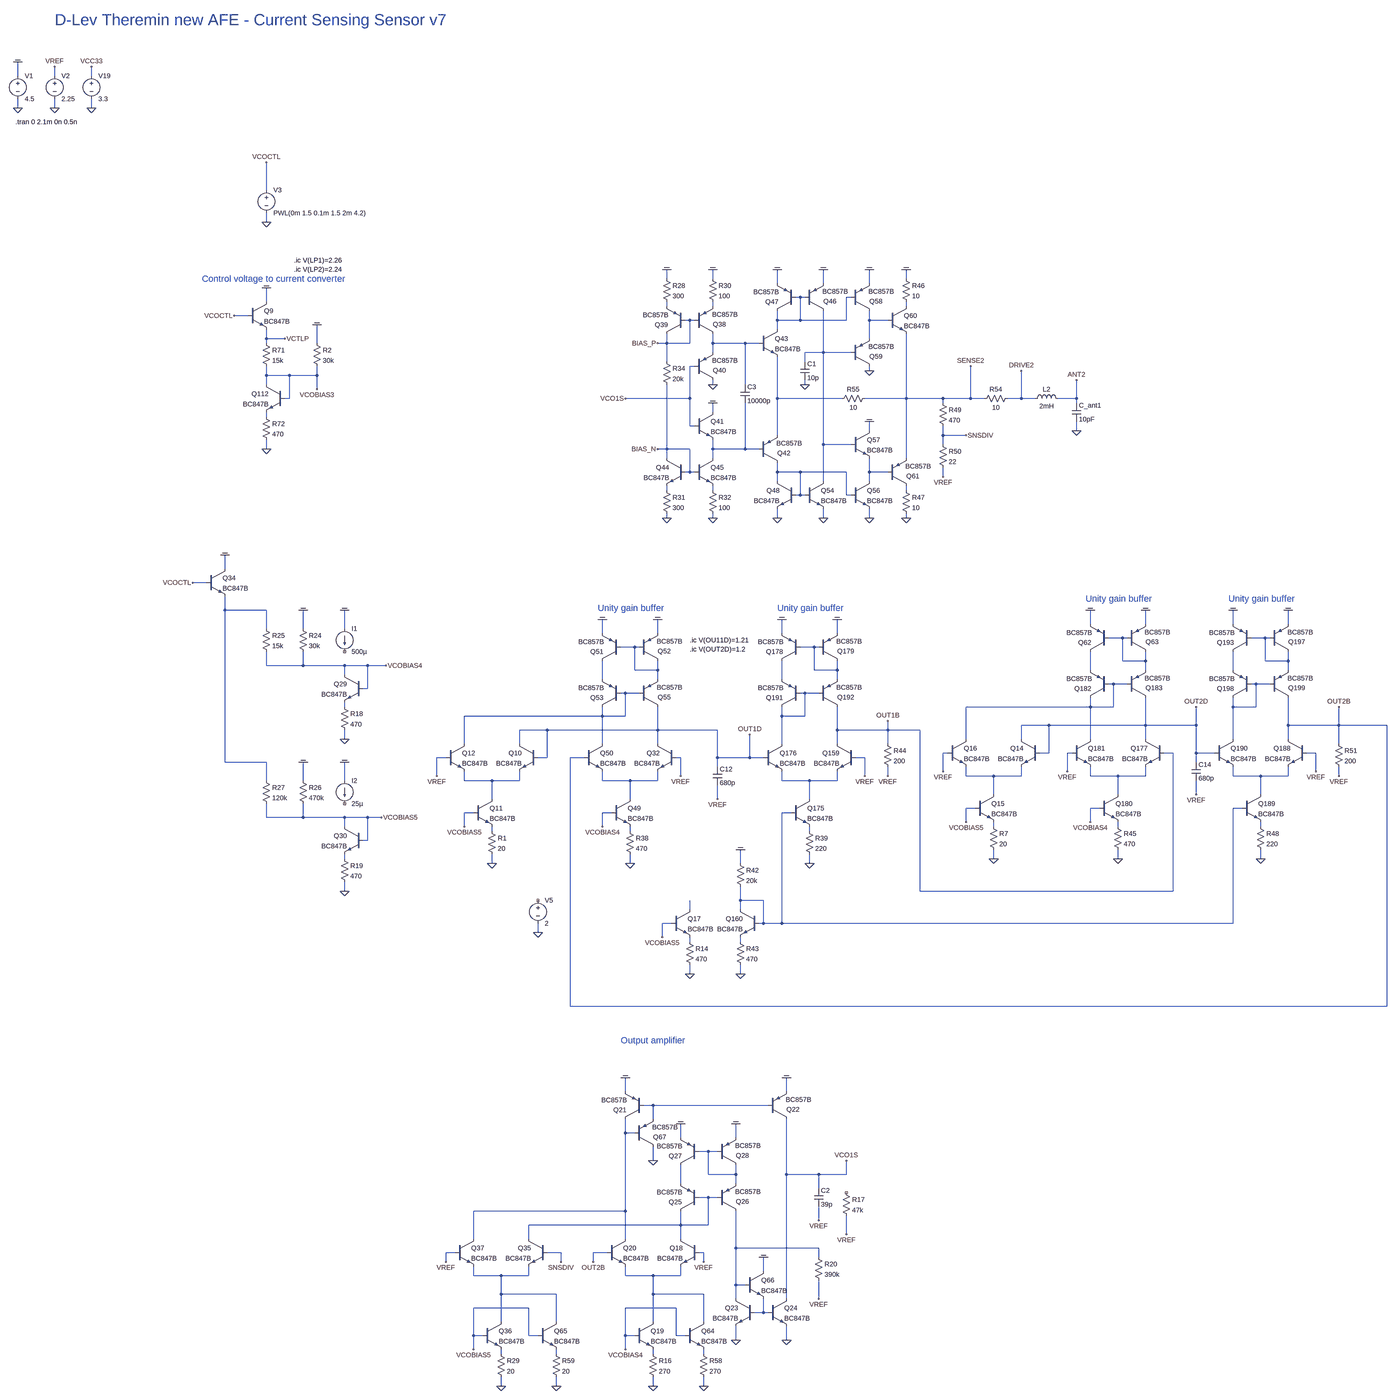
[diagram p0: schematic dlev_frontend_curr_sens_v13.asc, whole sheet]
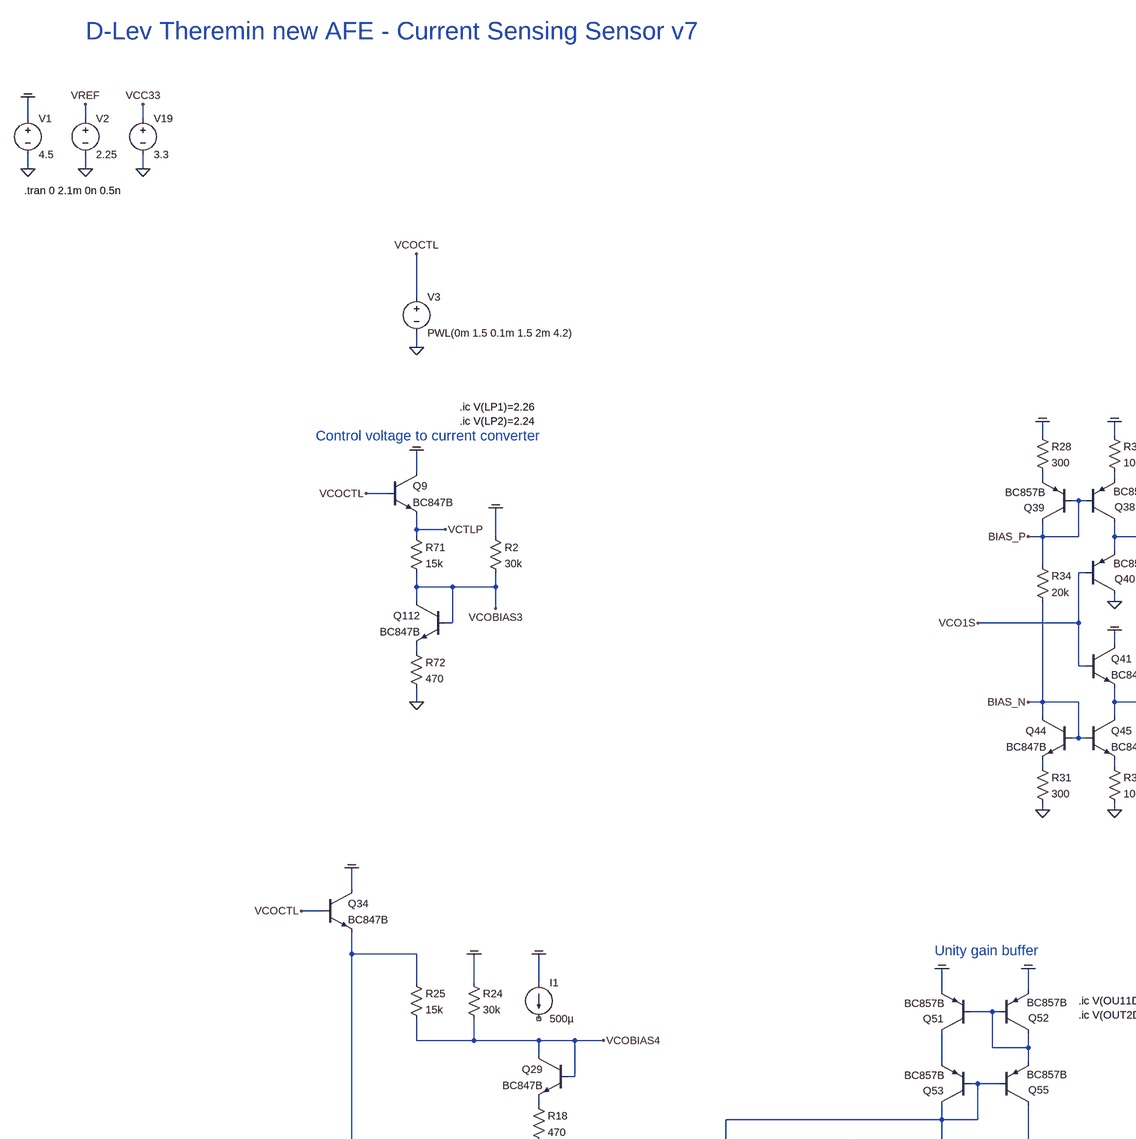
[diagram p1: schematic dlev_frontend_curr_sens_v13.asc, part, row 1 of 2, column 1 of 2]
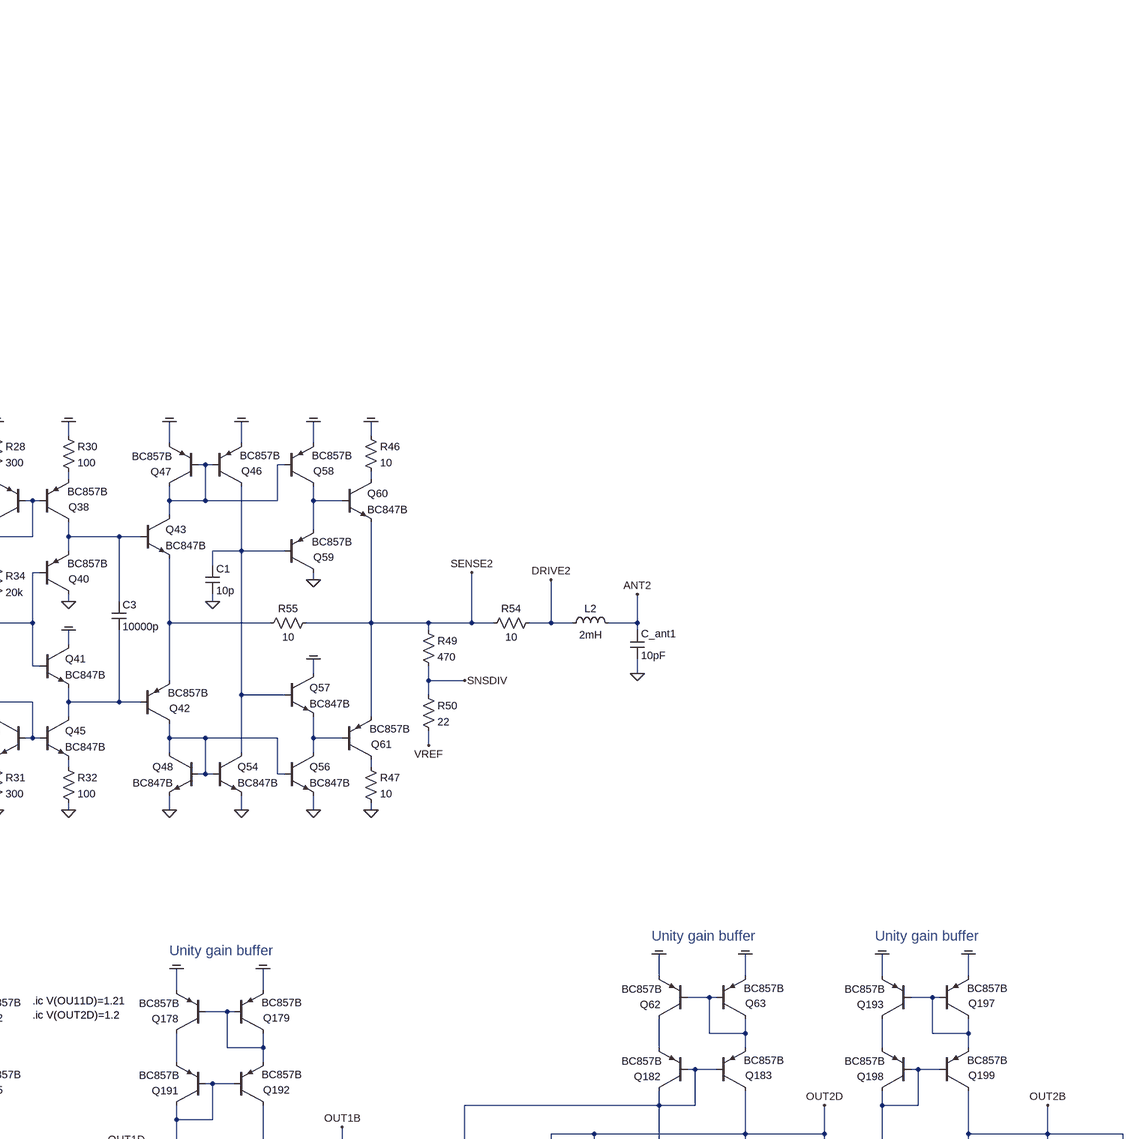
[diagram p2: schematic dlev_frontend_curr_sens_v13.asc, part, row 1 of 2, column 2 of 2]
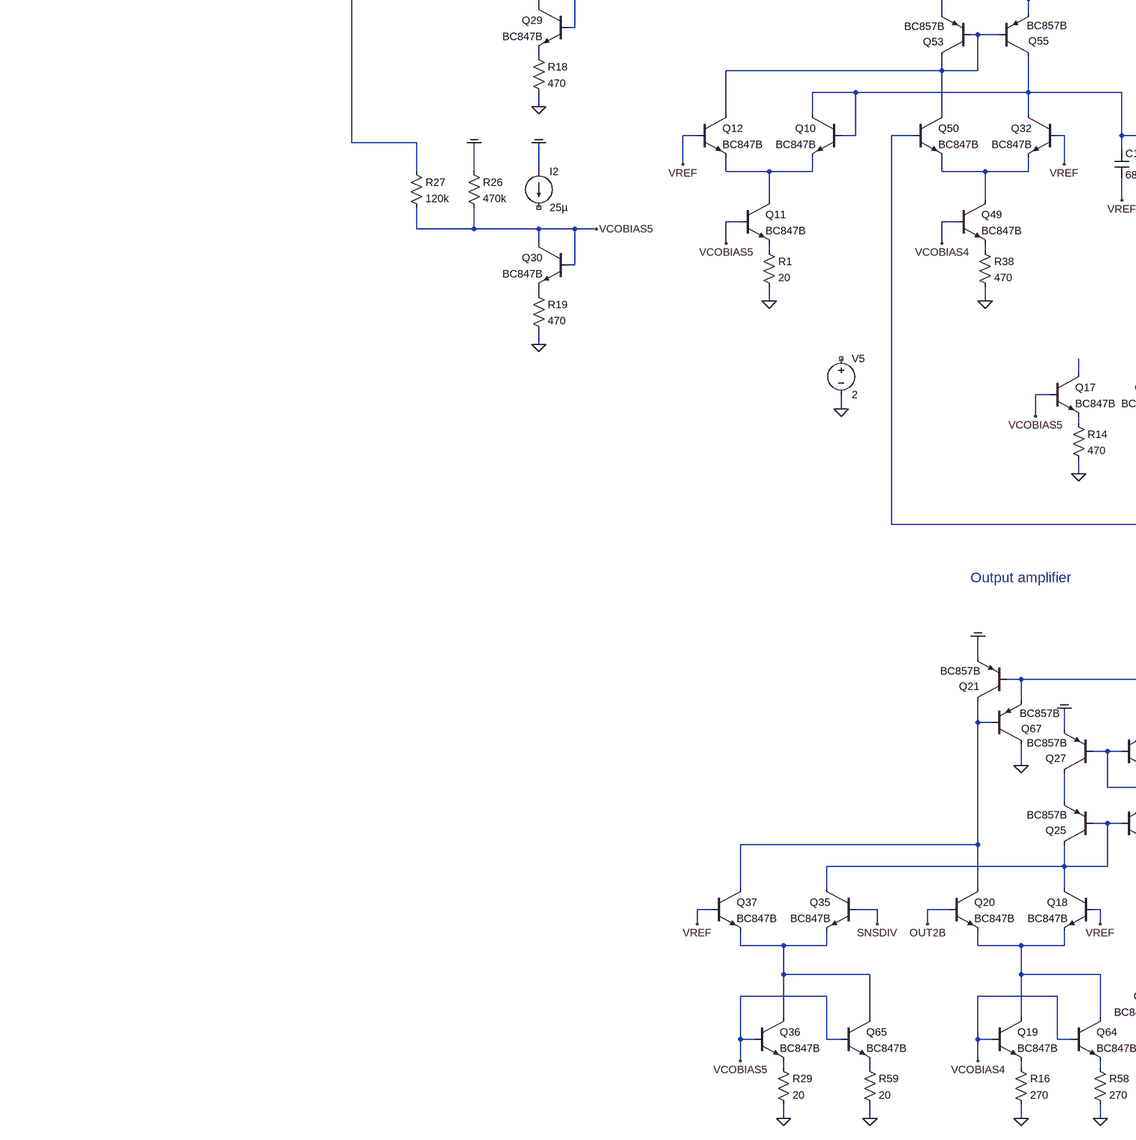
[diagram p3: schematic dlev_frontend_curr_sens_v13.asc, part, row 2 of 2, column 1 of 2]
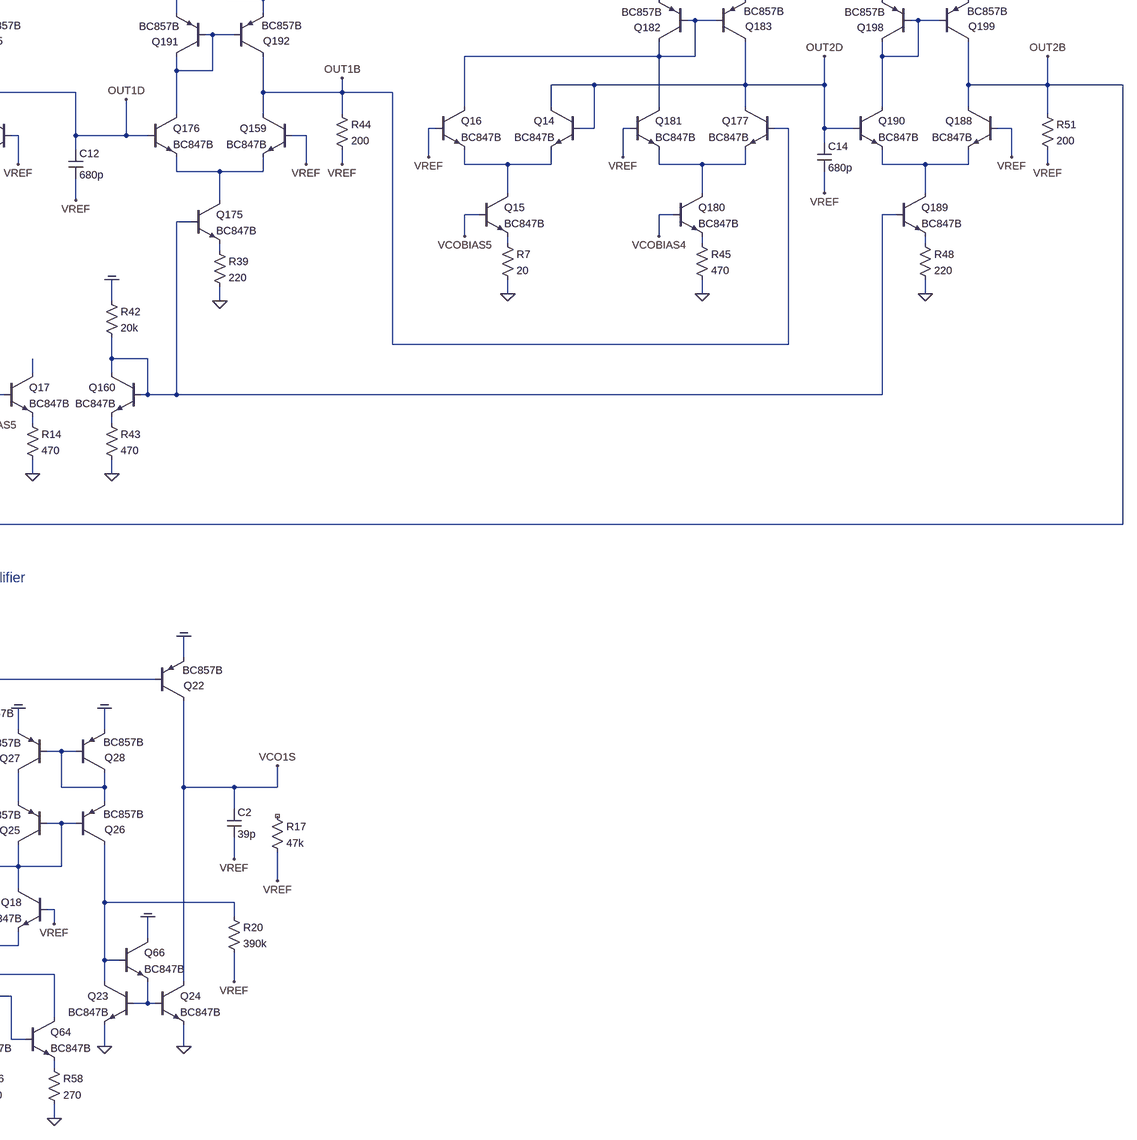
[diagram p4: schematic dlev_frontend_curr_sens_v13.asc, part, row 2 of 2, column 2 of 2]
dlev_frontend_curr_sens_v13.asc, the LTspice schematic file:
Version 4
SHEET 1 13504 15648
WIRE 48 2896 48 2848
WIRE 176 2896 176 2864
WIRE 304 2896 304 2864
WIRE 48 3008 48 2976
WIRE 176 3008 176 2976
WIRE 304 3008 304 2976
WIRE 912 3296 912 3200
WIRE 912 3408 912 3376
WIRE 2304 3616 2304 3584
WIRE 2464 3616 2464 3584
WIRE 3136 3616 3136 3584
WIRE 2688 3632 2688 3584
WIRE 2848 3632 2848 3584
WIRE 3008 3632 3008 3584
WIRE 2768 3680 2752 3680
WIRE 2784 3680 2768 3680
WIRE 2944 3680 2928 3680
WIRE 912 3696 912 3648
WIRE 2304 3712 2304 3696
WIRE 2464 3712 2464 3696
WIRE 3136 3712 3136 3696
WIRE 848 3744 800 3744
WIRE 2384 3760 2368 3760
WIRE 2400 3760 2384 3760
WIRE 2688 3760 2688 3728
WIRE 2768 3760 2768 3680
WIRE 2768 3760 2688 3760
WIRE 2928 3760 2928 3680
WIRE 2928 3760 2768 3760
WIRE 3008 3760 3008 3728
WIRE 3072 3760 3008 3760
WIRE 2688 3792 2688 3760
WIRE 912 3824 912 3792
WIRE 976 3824 912 3824
WIRE 3008 3824 3008 3760
WIRE 912 3840 912 3824
WIRE 1088 3840 1088 3776
WIRE 2304 3840 2304 3808
WIRE 2304 3840 2272 3840
WIRE 2384 3840 2384 3760
WIRE 2384 3840 2304 3840
WIRE 2464 3840 2464 3808
WIRE 2576 3840 2464 3840
WIRE 2624 3840 2576 3840
WIRE 2464 3872 2464 3840
WIRE 2848 3872 2848 3728
WIRE 2848 3872 2784 3872
WIRE 2944 3872 2848 3872
WIRE 2304 3904 2304 3840
WIRE 2784 3904 2784 3872
WIRE 2400 3920 2384 3920
WIRE 3008 3936 3008 3920
WIRE 912 3952 912 3920
WIRE 992 3952 912 3952
WIRE 1088 3952 1088 3920
WIRE 1088 3952 992 3952
WIRE 912 3984 912 3952
WIRE 2464 3984 2464 3968
WIRE 2576 3984 2576 3840
WIRE 2784 3984 2784 3968
WIRE 1088 4000 1088 3952
WIRE 992 4032 992 3952
WIRE 992 4032 976 4032
WIRE 2384 4032 2384 3920
WIRE 2384 4032 2160 4032
WIRE 2688 4032 2688 3888
WIRE 2912 4032 2688 4032
WIRE 3136 4032 3136 3808
WIRE 3136 4032 2992 4032
WIRE 3264 4032 3136 4032
WIRE 3360 4032 3360 3920
WIRE 3360 4032 3264 4032
WIRE 3408 4032 3360 4032
WIRE 3536 4032 3536 3936
WIRE 3536 4032 3488 4032
WIRE 3584 4032 3536 4032
WIRE 3728 4032 3728 3968
WIRE 3728 4032 3664 4032
WIRE 3264 4048 3264 4032
WIRE 3728 4048 3728 4032
WIRE 2464 4080 2464 4048
WIRE 912 4096 912 4080
WIRE 2384 4128 2384 4032
WIRE 2400 4128 2384 4128
WIRE 3008 4144 3008 4112
WIRE 3728 4144 3728 4112
WIRE 2688 4160 2688 4032
WIRE 3264 4160 3264 4128
WIRE 3344 4160 3264 4160
WIRE 2848 4192 2848 3872
WIRE 2944 4192 2848 4192
WIRE 3264 4192 3264 4160
WIRE 912 4208 912 4176
WIRE 2304 4208 2304 3984
WIRE 2304 4208 2272 4208
WIRE 2384 4208 2304 4208
WIRE 2464 4208 2464 4176
WIRE 2576 4208 2576 4048
WIRE 2576 4208 2464 4208
WIRE 2624 4208 2576 4208
WIRE 2304 4240 2304 4208
WIRE 2464 4240 2464 4208
WIRE 3136 4240 3136 4032
WIRE 2384 4288 2384 4208
WIRE 2384 4288 2368 4288
WIRE 2400 4288 2384 4288
WIRE 2688 4288 2688 4256
WIRE 2768 4288 2688 4288
WIRE 2928 4288 2768 4288
WIRE 3008 4288 3008 4240
WIRE 3072 4288 3008 4288
WIRE 3264 4304 3264 4272
WIRE 2688 4320 2688 4288
WIRE 2848 4320 2848 4192
WIRE 3008 4320 3008 4288
WIRE 2304 4352 2304 4336
WIRE 2464 4352 2464 4336
WIRE 3136 4352 3136 4336
WIRE 2768 4368 2768 4288
WIRE 2768 4368 2752 4368
WIRE 2784 4368 2768 4368
WIRE 2928 4368 2928 4288
WIRE 2944 4368 2928 4368
WIRE 2304 4448 2304 4432
WIRE 2464 4448 2464 4432
WIRE 2688 4448 2688 4416
WIRE 2848 4448 2848 4416
WIRE 3008 4448 3008 4416
WIRE 3136 4448 3136 4432
WIRE 768 4624 768 4576
WIRE 704 4672 656 4672
WIRE 768 4768 768 4720
WIRE 912 4768 768 4768
WIRE 3776 4816 3776 4768
WIRE 3968 4816 3968 4768
WIRE 4272 4816 4272 4768
WIRE 4464 4816 4464 4768
WIRE 912 4832 912 4768
WIRE 1040 4832 1040 4768
WIRE 1184 4832 1184 4768
WIRE 2080 4848 2080 4800
WIRE 2272 4848 2272 4800
WIRE 2704 4848 2704 4800
WIRE 2896 4848 2896 4800
WIRE 3888 4864 3840 4864
WIRE 3904 4864 3888 4864
WIRE 4384 4864 4336 4864
WIRE 4400 4864 4384 4864
WIRE 2192 4896 2144 4896
WIRE 2208 4896 2192 4896
WIRE 2816 4896 2768 4896
WIRE 2832 4896 2816 4896
WIRE 3888 4944 3888 4864
WIRE 3968 4944 3968 4912
WIRE 3968 4944 3888 4944
WIRE 4384 4944 4384 4864
WIRE 4464 4944 4464 4912
WIRE 4464 4944 4384 4944
WIRE 912 4960 912 4912
WIRE 1040 4960 1040 4912
WIRE 1040 4960 912 4960
WIRE 1184 4960 1040 4960
WIRE 1264 4960 1184 4960
WIRE 1328 4960 1264 4960
WIRE 2192 4976 2192 4896
WIRE 2272 4976 2272 4944
WIRE 2272 4976 2192 4976
WIRE 2816 4976 2816 4896
WIRE 2896 4976 2896 4944
WIRE 2896 4976 2816 4976
WIRE 3776 4976 3776 4912
WIRE 3968 4976 3968 4944
WIRE 4272 4976 4272 4912
WIRE 4464 4976 4464 4944
WIRE 1184 4992 1184 4960
WIRE 2080 5008 2080 4944
WIRE 2272 5008 2272 4976
WIRE 2704 5008 2704 4944
WIRE 2896 5008 2896 4976
WIRE 3856 5024 3840 5024
WIRE 3904 5024 3856 5024
WIRE 4352 5024 4336 5024
WIRE 4400 5024 4352 5024
WIRE 1264 5040 1264 4960
WIRE 1264 5040 1248 5040
WIRE 2160 5056 2144 5056
WIRE 2208 5056 2160 5056
WIRE 2784 5056 2768 5056
WIRE 2832 5056 2784 5056
WIRE 1184 5104 1184 5088
WIRE 3776 5104 3776 5072
WIRE 3776 5104 3344 5104
WIRE 3856 5104 3856 5024
WIRE 3856 5104 3776 5104
WIRE 4272 5104 4272 5072
WIRE 4352 5104 4352 5024
WIRE 4352 5104 4272 5104
WIRE 2080 5136 2080 5104
WIRE 2080 5136 1600 5136
WIRE 2160 5136 2160 5056
WIRE 2160 5136 2080 5136
WIRE 2704 5136 2704 5104
WIRE 2784 5136 2784 5056
WIRE 2784 5136 2704 5136
WIRE 3632 5168 3536 5168
WIRE 3968 5168 3968 5072
WIRE 3968 5168 3632 5168
WIRE 4144 5168 4144 5104
WIRE 4144 5168 3968 5168
WIRE 4464 5168 4464 5072
WIRE 4640 5168 4640 5104
WIRE 4640 5168 4464 5168
WIRE 4832 5168 4640 5168
WIRE 1888 5184 1792 5184
WIRE 2272 5184 2272 5104
WIRE 2272 5184 1888 5184
WIRE 2480 5184 2272 5184
WIRE 2896 5184 2896 5104
WIRE 3072 5184 3072 5152
WIRE 3072 5184 2896 5184
WIRE 3184 5184 3072 5184
WIRE 1184 5216 1184 5184
WIRE 3344 5216 3344 5104
WIRE 3536 5216 3536 5168
WIRE 3776 5216 3776 5104
WIRE 3968 5216 3968 5168
WIRE 4272 5216 4272 5104
WIRE 4464 5216 4464 5168
WIRE 1600 5232 1600 5136
WIRE 1792 5232 1792 5184
WIRE 2080 5232 2080 5136
WIRE 2272 5232 2272 5184
WIRE 2704 5232 2704 5136
WIRE 2896 5232 2896 5184
WIRE 3072 5232 3072 5184
WIRE 4640 5232 4640 5168
WIRE 3280 5264 3264 5264
WIRE 3632 5264 3632 5168
WIRE 3632 5264 3600 5264
WIRE 3712 5264 3696 5264
WIRE 4064 5264 4032 5264
WIRE 4144 5264 4144 5168
WIRE 4208 5264 4144 5264
WIRE 4560 5264 4528 5264
WIRE 1536 5280 1504 5280
WIRE 1888 5280 1888 5184
WIRE 1888 5280 1856 5280
WIRE 2016 5280 1968 5280
WIRE 2352 5280 2336 5280
WIRE 2480 5280 2480 5184
WIRE 2592 5280 2592 5200
WIRE 2592 5280 2480 5280
WIRE 2640 5280 2592 5280
WIRE 2992 5280 2960 5280
WIRE 768 5296 768 4768
WIRE 912 5296 768 5296
WIRE 4144 5296 4144 5264
WIRE 2480 5312 2480 5280
WIRE 3264 5328 3264 5264
WIRE 3696 5328 3696 5264
WIRE 4560 5328 4560 5264
WIRE 1504 5344 1504 5280
WIRE 2352 5344 2352 5280
WIRE 2992 5344 2992 5280
WIRE 3072 5344 3072 5312
WIRE 3344 5344 3344 5312
WIRE 3440 5344 3344 5344
WIRE 3536 5344 3536 5312
WIRE 3536 5344 3440 5344
WIRE 3776 5344 3776 5312
WIRE 3872 5344 3776 5344
WIRE 3968 5344 3968 5312
WIRE 3968 5344 3872 5344
WIRE 4272 5344 4272 5312
WIRE 4368 5344 4272 5344
WIRE 4464 5344 4464 5312
WIRE 4464 5344 4368 5344
WIRE 4640 5344 4640 5312
WIRE 912 5360 912 5296
WIRE 1040 5360 1040 5296
WIRE 1184 5360 1184 5296
WIRE 1600 5360 1600 5328
WIRE 1696 5360 1600 5360
WIRE 1792 5360 1792 5328
WIRE 1792 5360 1696 5360
WIRE 2080 5360 2080 5328
WIRE 2176 5360 2080 5360
WIRE 2272 5360 2272 5328
WIRE 2272 5360 2176 5360
WIRE 2704 5360 2704 5328
WIRE 2800 5360 2704 5360
WIRE 2896 5360 2896 5328
WIRE 2896 5360 2800 5360
WIRE 3440 5408 3440 5344
WIRE 3872 5408 3872 5344
WIRE 4144 5408 4144 5360
WIRE 4368 5408 4368 5344
WIRE 1696 5424 1696 5360
WIRE 2176 5424 2176 5360
WIRE 2480 5424 2480 5376
WIRE 2800 5424 2800 5360
WIRE 3376 5456 3344 5456
WIRE 3808 5456 3776 5456
WIRE 4304 5456 4272 5456
WIRE 1632 5472 1600 5472
WIRE 2112 5472 2080 5472
WIRE 2736 5472 2704 5472
WIRE 912 5488 912 5440
WIRE 1040 5488 1040 5440
WIRE 1040 5488 912 5488
WIRE 1184 5488 1040 5488
WIRE 1264 5488 1184 5488
WIRE 1312 5488 1264 5488
WIRE 3344 5504 3344 5456
WIRE 3776 5504 3776 5456
WIRE 1184 5520 1184 5488
WIRE 1600 5520 1600 5472
WIRE 2080 5520 2080 5472
WIRE 3440 5520 3440 5504
WIRE 3872 5520 3872 5504
WIRE 4368 5520 4368 5504
WIRE 1696 5536 1696 5520
WIRE 2176 5536 2176 5520
WIRE 2800 5536 2800 5520
WIRE 1264 5568 1264 5488
WIRE 1264 5568 1248 5568
WIRE 1184 5632 1184 5616
WIRE 3440 5632 3440 5600
WIRE 3872 5632 3872 5600
WIRE 4368 5632 4368 5600
WIRE 1696 5648 1696 5616
WIRE 2176 5648 2176 5616
WIRE 2560 5648 2560 5600
WIRE 2800 5648 2800 5616
WIRE 1184 5744 1184 5712
WIRE 3184 5744 3184 5184
WIRE 4064 5744 4064 5264
WIRE 4064 5744 3184 5744
WIRE 2560 5776 2560 5728
WIRE 2640 5776 2560 5776
WIRE 2384 5808 2384 5776
WIRE 2560 5808 2560 5776
WIRE 2320 5856 2288 5856
WIRE 2640 5856 2640 5776
WIRE 2640 5856 2624 5856
WIRE 2704 5856 2704 5472
WIRE 2704 5856 2640 5856
WIRE 4272 5856 4272 5456
WIRE 4272 5856 2704 5856
WIRE 1856 5888 1856 5856
WIRE 2288 5904 2288 5856
WIRE 2384 5920 2384 5904
WIRE 2560 5920 2560 5904
WIRE 2384 6032 2384 6000
WIRE 2560 6032 2560 6000
WIRE 1968 6144 1968 5280
WIRE 4832 6144 4832 5168
WIRE 4832 6144 1968 6144
WIRE 2160 6592 2160 6544
WIRE 2720 6592 2720 6544
WIRE 2256 6640 2224 6640
WIRE 2656 6640 2256 6640
WIRE 2256 6688 2256 6640
WIRE 2160 6736 2160 6688
WIRE 2192 6736 2160 6736
WIRE 2352 6752 2352 6704
WIRE 2544 6752 2544 6704
WIRE 2448 6800 2416 6800
WIRE 2480 6800 2448 6800
WIRE 2256 6832 2256 6784
WIRE 2448 6880 2448 6800
WIRE 2544 6880 2544 6848
WIRE 2544 6880 2448 6880
WIRE 2720 6880 2720 6688
WIRE 2832 6880 2720 6880
WIRE 2928 6880 2928 6832
WIRE 2928 6880 2832 6880
WIRE 2352 6912 2352 6848
WIRE 2544 6912 2544 6880
WIRE 2832 6928 2832 6880
WIRE 2448 6960 2416 6960
WIRE 2480 6960 2448 6960
WIRE 2160 7008 2160 6736
WIRE 2160 7008 1632 7008
WIRE 2832 7040 2832 6992
WIRE 2352 7056 2352 7008
WIRE 2352 7056 1824 7056
WIRE 2448 7056 2448 6960
WIRE 2448 7056 2352 7056
WIRE 2928 7088 2928 7024
WIRE 1632 7104 1632 7008
WIRE 1824 7104 1824 7056
WIRE 2160 7104 2160 7008
WIRE 2352 7104 2352 7056
WIRE 2544 7136 2544 7008
WIRE 2832 7136 2544 7136
WIRE 1568 7152 1536 7152
WIRE 1936 7152 1888 7152
WIRE 2096 7152 2048 7152
WIRE 2432 7152 2416 7152
WIRE 2832 7168 2832 7136
WIRE 1536 7184 1536 7152
WIRE 1936 7184 1936 7152
WIRE 2048 7184 2048 7152
WIRE 2432 7184 2432 7152
WIRE 2640 7216 2640 7168
WIRE 1632 7232 1632 7200
WIRE 1728 7232 1632 7232
WIRE 1824 7232 1824 7200
WIRE 1824 7232 1728 7232
WIRE 2160 7232 2160 7200
WIRE 2256 7232 2160 7232
WIRE 2352 7232 2352 7200
WIRE 2352 7232 2256 7232
WIRE 2544 7264 2544 7136
WIRE 2576 7264 2544 7264
WIRE 1728 7296 1728 7232
WIRE 1920 7296 1728 7296
WIRE 2256 7296 2256 7232
WIRE 2432 7296 2256 7296
WIRE 2544 7312 2544 7264
WIRE 2720 7312 2720 6880
WIRE 2832 7312 2832 7248
WIRE 1824 7344 1632 7344
WIRE 2336 7344 2160 7344
WIRE 2640 7360 2640 7312
WIRE 2640 7360 2608 7360
WIRE 2656 7360 2640 7360
WIRE 1728 7392 1728 7296
WIRE 1920 7392 1920 7296
WIRE 2256 7392 2256 7296
WIRE 2432 7392 2432 7296
WIRE 1632 7440 1632 7344
WIRE 1664 7440 1632 7440
WIRE 1824 7440 1824 7344
WIRE 1856 7440 1824 7440
WIRE 2160 7440 2160 7344
WIRE 2192 7440 2160 7440
WIRE 2336 7440 2336 7344
WIRE 2368 7440 2336 7440
WIRE 2544 7456 2544 7408
WIRE 2720 7456 2720 7408
WIRE 1632 7488 1632 7440
WIRE 2160 7488 2160 7440
WIRE 1728 7504 1728 7488
WIRE 1920 7504 1920 7488
WIRE 2256 7504 2256 7488
WIRE 2432 7504 2432 7488
WIRE 1728 7616 1728 7584
WIRE 1920 7616 1920 7584
WIRE 2256 7616 2256 7584
WIRE 2432 7616 2432 7584
FLAG 48 3008 0
FLAG 48 2848 COM
FLAG 176 3008 0
FLAG 176 2864 VREF
FLAG 304 3008 0
FLAG 304 2864 VCC33
FLAG 912 4208 0
FLAG 1088 4000 VCOBIAS3
FLAG 912 3648 COM
FLAG 800 3744 VCOCTL
FLAG 912 3200 VCOCTL
FLAG 912 3408 0
FLAG 976 3824 VCTLP
FLAG 1088 3776 COM
FLAG 2176 5648 0
FLAG 2080 5520 VCOBIAS4
FLAG 2352 5344 VREF
FLAG 2480 5424 VREF
FLAG 2800 5648 0
FLAG 2560 5600 COM
FLAG 2560 6032 0
FLAG 2992 5344 VREF
FLAG 3072 5344 VREF
FLAG 3872 5632 0
FLAG 3776 5504 VCOBIAS4
FLAG 3696 5328 VREF
FLAG 4144 5408 VREF
FLAG 4368 5632 0
FLAG 4560 5328 VREF
FLAG 4640 5344 VREF
FLAG 1328 4960 VCOBIAS4
FLAG 2592 5200 OUT1D
FLAG 4144 5104 OUT2D
FLAG 2704 4800 COM
FLAG 2896 4800 COM
FLAG 4272 4768 COM
FLAG 4464 4768 COM
FLAG 3072 5152 OUT1B
FLAG 4640 5104 OUT2B
FLAG 2080 4800 COM
FLAG 2272 4800 COM
FLAG 3776 4768 COM
FLAG 3968 4768 COM
FLAG 1696 5648 0
FLAG 1600 5520 VCOBIAS5
FLAG 1504 5344 VREF
FLAG 3440 5632 0
FLAG 3344 5504 VCOBIAS5
FLAG 3264 5328 VREF
FLAG 1312 5488 VCOBIAS5
FLAG 2384 6032 0
FLAG 2288 5904 VCOBIAS5
FLAG 2256 7616 0
FLAG 2160 7488 VCOBIAS4
FLAG 2432 7184 VREF
FLAG 2160 6544 COM
FLAG 2720 6544 COM
FLAG 2352 6704 COM
FLAG 2544 6704 COM
FLAG 2544 7456 0
FLAG 2720 7456 0
FLAG 2832 7040 VREF
FLAG 1184 4768 COM
FLAG 1184 5296 COM
FLAG 1184 5216 0
FLAG 1184 5744 0
FLAG 1856 5888 0
FLAG 2928 6832 VCO1S
FLAG 2048 7184 OUT2B
FLAG 1040 4768 COM
FLAG 1040 5296 COM
FLAG 768 4576 COM
FLAG 656 4672 VCOCTL
FLAG 1728 7616 0
FLAG 1632 7488 VCOBIAS5
FLAG 1536 7184 VREF
FLAG 2928 7088 VREF
FLAG 2304 4448 0
FLAG 2464 4448 0
FLAG 2464 3584 COM
FLAG 2304 3584 COM
FLAG 2464 3984 0
FLAG 2464 4048 COM
FLAG 2272 4208 BIAS_N
FLAG 2272 3840 BIAS_P
FLAG 2848 3584 COM
FLAG 2688 3584 COM
FLAG 2688 4448 0
FLAG 2848 4448 0
FLAG 2784 3984 0
FLAG 3008 4448 0
FLAG 3008 4112 COM
FLAG 3008 3584 COM
FLAG 3008 3936 0
FLAG 3136 3584 COM
FLAG 3136 4448 0
FLAG 3264 4304 VREF
FLAG 2160 4032 VCO1S
FLAG 3728 4144 0
FLAG 3728 3968 ANT2
FLAG 3536 3936 DRIVE2
FLAG 3360 3920 SENSE2
FLAG 3344 4160 SNSDIV
FLAG 1936 7184 SNSDIV
FLAG 2432 7616 0
FLAG 1920 7616 0
FLAG 2640 7168 COM
FLAG 2256 6832 0
FLAG 2832 7312 VREF
SYMBOL voltage 48 2880 R0
SYMATTR InstName V1
SYMATTR Value 4.5
SYMBOL Voltage 176 2880 R0
SYMATTR InstName V2
SYMATTR Value 2.25
SYMBOL Voltage 304 2880 R0
SYMATTR InstName V19
SYMATTR Value 3.3
SYMBOL npn 976 3984 M0
SYMATTR InstName Q112
SYMATTR Value BC847B
SYMBOL Res 896 3824 R0
SYMATTR InstName R71
SYMATTR Value 15k
SYMBOL Res 896 4080 R0
SYMATTR InstName R72
SYMATTR Value 470
SYMBOL npn 848 3696 R0
SYMATTR InstName Q9
SYMATTR Value BC847B
SYMBOL Voltage 912 3280 R0
SYMATTR InstName V3
SYMATTR Value PWL(0m 1.5 0.1m 1.5 2m 4.2)
SYMBOL Res 1072 3824 R0
SYMATTR InstName R2
SYMATTR Value 30k
SYMBOL npn 2336 5232 M0
SYMATTR InstName Q32
SYMATTR Value BC847B
SYMBOL npn 2112 5424 R0
SYMATTR InstName Q49
SYMATTR Value BC847B
SYMBOL Res 2160 5520 R0
SYMATTR InstName R38
SYMATTR Value 470
SYMBOL npn 2016 5232 R0
SYMATTR InstName Q50
SYMATTR Value BC847B
SYMBOL Cap 2464 5312 R0
SYMATTR InstName C12
SYMATTR Value 680p
SYMBOL npn 2960 5232 M0
SYMATTR InstName Q159
SYMATTR Value BC847B
SYMBOL npn 2736 5424 R0
SYMATTR InstName Q175
SYMATTR Value BC847B
SYMBOL Res 2784 5520 R0
SYMATTR InstName R39
SYMATTR Value 220
SYMBOL npn 2640 5232 R0
SYMATTR InstName Q176
SYMATTR Value BC847B
SYMBOL npn 2624 5808 M0
SYMATTR InstName Q160
SYMATTR Value BC847B
SYMBOL Res 2544 5632 R0
SYMATTR InstName R42
SYMATTR Value 20k
SYMBOL Res 2544 5904 R0
SYMATTR InstName R43
SYMATTR Value 470
SYMBOL Res 3056 5216 R0
SYMATTR InstName R44
SYMATTR Value 200
SYMBOL npn 4032 5216 M0
SYMATTR InstName Q177
SYMATTR Value BC847B
SYMBOL npn 3808 5408 R0
SYMATTR InstName Q180
SYMATTR Value BC847B
SYMBOL Res 3856 5504 R0
SYMATTR InstName R45
SYMATTR Value 470
SYMBOL npn 3712 5216 R0
SYMATTR InstName Q181
SYMATTR Value BC847B
SYMBOL Cap 4128 5296 R0
SYMATTR InstName C14
SYMATTR Value 680p
SYMBOL npn 4528 5216 M0
SYMATTR InstName Q188
SYMATTR Value BC847B
SYMBOL npn 4304 5408 R0
SYMATTR InstName Q189
SYMATTR Value BC847B
SYMBOL Res 4352 5504 R0
SYMATTR InstName R48
SYMATTR Value 220
SYMBOL npn 4208 5216 R0
SYMATTR InstName Q190
SYMATTR Value BC847B
SYMBOL Res 4624 5216 R0
SYMATTR InstName R51
SYMATTR Value 200
SYMBOL pnp 2768 4944 R180
WINDOW 0 60 32 Left 2
WINDOW 3 58 66 Left 2
SYMATTR InstName Q178
SYMATTR Value BC857B
SYMBOL pnp 2832 4944 M180
WINDOW 0 64 34 Left 2
WINDOW 3 61 68 Left 2
SYMATTR InstName Q179
SYMATTR Value BC857B
SYMBOL pnp 2768 5104 R180
WINDOW 0 60 32 Left 2
WINDOW 3 58 66 Left 2
SYMATTR InstName Q191
SYMATTR Value BC857B
SYMBOL pnp 2832 5104 M180
WINDOW 0 64 34 Left 2
WINDOW 3 61 68 Left 2
SYMATTR InstName Q192
SYMATTR Value BC857B
SYMBOL pnp 4336 4912 R180
WINDOW 0 60 32 Left 2
WINDOW 3 58 66 Left 2
SYMATTR InstName Q193
SYMATTR Value BC857B
SYMBOL pnp 4400 4912 M180
WINDOW 0 64 34 Left 2
WINDOW 3 61 68 Left 2
SYMATTR InstName Q197
SYMATTR Value BC857B
SYMBOL pnp 4336 5072 R180
WINDOW 0 60 32 Left 2
WINDOW 3 58 66 Left 2
SYMATTR InstName Q198
SYMATTR Value BC857B
SYMBOL pnp 4400 5072 M180
WINDOW 0 64 34 Left 2
WINDOW 3 61 68 Left 2
SYMATTR InstName Q199
SYMATTR Value BC857B
SYMBOL pnp 2144 4944 R180
WINDOW 0 60 32 Left 2
WINDOW 3 58 66 Left 2
SYMATTR InstName Q51
SYMATTR Value BC857B
SYMBOL pnp 2208 4944 M180
WINDOW 0 64 34 Left 2
WINDOW 3 61 68 Left 2
SYMATTR InstName Q52
SYMATTR Value BC857B
SYMBOL pnp 2144 5104 R180
WINDOW 0 60 32 Left 2
WINDOW 3 58 66 Left 2
SYMATTR InstName Q53
SYMATTR Value BC857B
SYMBOL pnp 2208 5104 M180
WINDOW 0 64 34 Left 2
WINDOW 3 61 68 Left 2
SYMATTR InstName Q55
SYMATTR Value BC857B
SYMBOL pnp 3840 4912 R180
WINDOW 0 60 32 Left 2
WINDOW 3 58 66 Left 2
SYMATTR InstName Q62
SYMATTR Value BC857B
SYMBOL pnp 3904 4912 M180
WINDOW 0 64 34 Left 2
WINDOW 3 61 68 Left 2
SYMATTR InstName Q63
SYMATTR Value BC857B
SYMBOL pnp 3840 5072 R180
WINDOW 0 60 32 Left 2
WINDOW 3 58 66 Left 2
SYMATTR InstName Q182
SYMATTR Value BC857B
SYMBOL pnp 3904 5072 M180
WINDOW 0 64 34 Left 2
WINDOW 3 61 68 Left 2
SYMATTR InstName Q183
SYMATTR Value BC857B
SYMBOL npn 1856 5232 M0
SYMATTR InstName Q10
SYMATTR Value BC847B
SYMBOL npn 1632 5424 R0
SYMATTR InstName Q11
SYMATTR Value BC847B
SYMBOL Res 1680 5520 R0
SYMATTR InstName R1
SYMATTR Value 20
SYMBOL npn 1536 5232 R0
SYMATTR InstName Q12
SYMATTR Value BC847B
SYMBOL npn 3600 5216 M0
SYMATTR InstName Q14
SYMATTR Value BC847B
SYMBOL npn 3376 5408 R0
SYMATTR InstName Q15
SYMATTR Value BC847B
SYMBOL Res 3424 5504 R0
SYMATTR InstName R7
SYMATTR Value 20
SYMBOL npn 3280 5216 R0
SYMATTR InstName Q16
SYMATTR Value BC847B
SYMBOL npn 2320 5808 R0
SYMATTR InstName Q17
SYMATTR Value BC847B
SYMBOL Res 2368 5904 R0
SYMATTR InstName R14
SYMATTR Value 470
SYMBOL npn 2416 7104 M0
SYMATTR InstName Q18
SYMATTR Value BC847B
SYMBOL npn 2192 7392 R0
SYMATTR InstName Q19
SYMATTR Value BC847B
SYMBOL Res 2240 7488 R0
SYMATTR InstName R16
SYMATTR Value 270
SYMBOL npn 2096 7104 R0
SYMATTR InstName Q20
SYMATTR Value BC847B
SYMBOL pnp 2224 6688 R180
WINDOW 0 60 32 Left 2
WINDOW 3 58 66 Left 2
SYMATTR InstName Q21
SYMATTR Value BC857B
SYMBOL pnp 2656 6688 M180
WINDOW 0 64 34 Left 2
WINDOW 3 61 68 Left 2
SYMATTR InstName Q22
SYMATTR Value BC857B
SYMBOL pnp 2416 6848 R180
WINDOW 0 60 32 Left 2
WINDOW 3 58 66 Left 2
SYMATTR InstName Q27
SYMATTR Value BC857B
SYMBOL pnp 2480 6848 M180
WINDOW 0 64 34 Left 2
WINDOW 3 61 68 Left 2
SYMATTR InstName Q28
SYMATTR Value BC857B
SYMBOL npn 2608 7312 M0
SYMATTR InstName Q23
SYMATTR Value BC847B
SYMBOL npn 2656 7312 R0
SYMATTR InstName Q24
SYMATTR Value BC847B
SYMBOL Cap 2816 6928 R0
SYMATTR InstName C2
SYMATTR Value 39p
SYMBOL current 1184 4832 R0
SYMATTR InstName I1
SYMATTR Value 500µ
SYMBOL current 1184 5360 R0
SYMATTR InstName I2
SYMATTR Value 25µ
SYMBOL npn 1248 4992 M0
SYMATTR InstName Q29
SYMATTR Value BC847B
SYMBOL Res 1168 5088 R0
SYMATTR InstName R18
SYMATTR Value 470
SYMBOL npn 1248 5520 M0
SYMATTR InstName Q30
SYMATTR Value BC847B
SYMBOL Res 1168 5616 R0
SYMATTR InstName R19
SYMATTR Value 470
SYMBOL Voltage 1856 5760 R0
SYMATTR InstName V5
SYMATTR Value 2
SYMBOL Res 1024 4816 R0
SYMATTR InstName R24
SYMATTR Value 30k
SYMBOL Res 896 4816 R0
SYMATTR InstName R25
SYMATTR Value 15k
SYMBOL Res 1024 5344 R0
SYMATTR InstName R26
SYMATTR Value 470k
SYMBOL Res 896 5344 R0
SYMATTR InstName R27
SYMATTR Value 120k
SYMBOL npn 704 4624 R0
SYMATTR InstName Q34
SYMATTR Value BC847B
SYMBOL npn 1888 7104 M0
SYMATTR InstName Q35
SYMATTR Value BC847B
SYMBOL npn 1664 7392 R0
SYMATTR InstName Q36
SYMATTR Value BC847B
SYMBOL Res 1712 7488 R0
SYMATTR InstName R29
SYMATTR Value 20
SYMBOL npn 1568 7104 R0
SYMATTR InstName Q37
SYMATTR Value BC847B
SYMBOL pnp 2416 7008 R180
WINDOW 0 60 32 Left 2
WINDOW 3 58 66 Left 2
SYMATTR InstName Q25
SYMATTR Value BC857B
SYMBOL pnp 2480 7008 M180
WINDOW 0 64 34 Left 2
WINDOW 3 61 68 Left 2
SYMATTR InstName Q26
SYMATTR Value BC857B
SYMBOL Res 2912 6928 R0
SYMATTR InstName R17
SYMATTR Value 47k
SYMBOL pnp 2400 3808 M180
WINDOW 0 64 34 Left 2
WINDOW 3 61 68 Left 2
SYMATTR InstName Q38
SYMATTR Value BC857B
SYMBOL pnp 2368 3808 R180
WINDOW 0 60 32 Left 2
WINDOW 3 58 66 Left 2
SYMATTR InstName Q39
SYMATTR Value BC857B
SYMBOL pnp 2400 3968 M180
WINDOW 0 64 34 Left 2
WINDOW 3 61 68 Left 2
SYMATTR InstName Q40
SYMATTR Value BC857B
SYMBOL npn 2400 4080 R0
SYMATTR InstName Q41
SYMATTR Value BC847B
SYMBOL pnp 2624 4256 M180
WINDOW 0 64 34 Left 2
WINDOW 3 61 68 Left 2
SYMATTR InstName Q42
SYMATTR Value BC857B
SYMBOL npn 2624 3792 R0
SYMATTR InstName Q43
SYMATTR Value BC847B
SYMBOL Res 2288 3600 R0
SYMATTR InstName R28
SYMATTR Value 300
SYMBOL Res 2448 3600 R0
SYMATTR InstName R30
SYMATTR Value 100
SYMBOL Res 2288 4336 R0
SYMATTR InstName R31
SYMATTR Value 300
SYMBOL Res 2448 4336 R0
SYMATTR InstName R32
SYMATTR Value 100
SYMBOL npn 2368 4240 M0
SYMATTR InstName Q44
SYMATTR Value BC847B
SYMBOL npn 2400 4240 R0
SYMATTR InstName Q45
SYMATTR Value BC847B
SYMBOL Res 2288 3888 R0
SYMATTR InstName R34
SYMATTR Value 20k
SYMBOL pnp 2784 3728 M180
WINDOW 0 64 34 Left 2
WINDOW 3 61 68 Left 2
SYMATTR InstName Q46
SYMATTR Value BC857B
SYMBOL pnp 2752 3728 R180
WINDOW 0 60 32 Left 2
WINDOW 3 58 66 Left 2
SYMATTR InstName Q47
SYMATTR Value BC857B
SYMBOL npn 2752 4320 M0
SYMATTR InstName Q48
SYMATTR Value BC847B
SYMBOL npn 2784 4320 R0
SYMATTR InstName Q54
SYMATTR Value BC847B
SYMBOL Cap 2768 3904 R0
SYMATTR InstName C1
SYMATTR Value 10p
SYMBOL npn 2944 4320 R0
SYMATTR InstName Q56
SYMATTR Value BC847B
SYMBOL npn 2944 4144 R0
SYMATTR InstName Q57
SYMATTR Value BC847B
SYMBOL pnp 2944 3728 M180
WINDOW 0 64 34 Left 2
WINDOW 3 61 68 Left 2
SYMATTR InstName Q58
SYMATTR Value BC857B
SYMBOL pnp 2944 3920 M180
WINDOW 0 64 34 Left 2
WINDOW 3 61 68 Left 2
SYMATTR InstName Q59
SYMATTR Value BC857B
SYMBOL npn 3072 3712 R0
SYMATTR InstName Q60
SYMATTR Value BC847B
SYMBOL pnp 3072 4336 M180
WINDOW 0 64 34 Left 2
WINDOW 3 61 68 Left 2
SYMATTR InstName Q61
SYMATTR Value BC857B
SYMBOL Res 3120 3600 R0
SYMATTR InstName R46
SYMATTR Value 10
SYMBOL Res 3120 4336 R0
SYMATTR InstName R47
SYMATTR Value 10
SYMBOL Res 3248 4032 R0
SYMATTR InstName R49
SYMATTR Value 470
SYMBOL Res 3248 4176 R0
SYMATTR InstName R50
SYMATTR Value 22
SYMBOL ind 3568 4048 R270
WINDOW 0 32 56 VTop 2
WINDOW 3 5 56 VBottom 2
SYMATTR InstName L2
SYMATTR Value 2mH
SYMATTR SpiceLine Rser=120 Cpar=1pF
SYMBOL Cap 3712 4048 R0
SYMATTR InstName C_ant1
SYMATTR Value 10pF
SYMBOL Res 3392 4048 R270
WINDOW 0 32 56 VTop 2
WINDOW 3 0 56 VBottom 2
SYMATTR InstName R54
SYMATTR Value 10
SYMBOL Res 3008 4016 R90
WINDOW 0 0 56 VBottom 2
WINDOW 3 32 56 VTop 2
SYMATTR InstName R55
SYMATTR Value 10
SYMBOL npn 2368 7392 R0
SYMATTR InstName Q64
SYMATTR Value BC847B
SYMBOL Res 2416 7488 R0
SYMATTR InstName R58
SYMATTR Value 270
SYMBOL npn 1856 7392 R0
SYMATTR InstName Q65
SYMATTR Value BC847B
SYMBOL Res 1904 7488 R0
SYMATTR InstName R59
SYMATTR Value 20
SYMBOL npn 2576 7216 R0
SYMATTR InstName Q66
SYMATTR Value BC847B
SYMBOL pnp 2192 6784 M180
WINDOW 0 64 34 Left 2
WINDOW 3 61 68 Left 2
SYMATTR InstName Q67
SYMATTR Value BC857B
SYMBOL Res 2816 7152 R0
SYMATTR InstName R20
SYMATTR Value 390k
SYMBOL Cap 2560 3984 R0
SYMATTR InstName C3
SYMATTR Value 10000p
TEXT 40 3056 Left 2 !.tran 0 2.1m 0n 0.5n
TEXT 176 2624 Left 5 ;D-Lev Theremin new AFE - Current Sensing Sensor v7
TEXT 1008 3552 Left 2 !.ic V(LP1)=2.26\n.ic V(LP2)=2.24
TEXT 688 3616 Left 3 ;Control voltage to current converter
TEXT 2384 4872 Left 2 !.ic V(OU11D)=1.21\n.ic V(OUT2D)=1.2
TEXT 2688 4760 Left 3 ;Unity gain buffer
TEXT 4256 4728 Left 3 ;Unity gain buffer
TEXT 2064 4760 Left 3 ;Unity gain buffer
TEXT 3760 4728 Left 3 ;Unity gain buffer
TEXT 2144 6408 Left 3 ;Output amplifier

The netlist it stands for:
* dlev_frontend_curr_sens_v13.asc
V1 COM 0 4.5
V2 VREF 0 2.25
V19 VCC33 0 3.3
Q112 VCOBIAS3 VCOBIAS3 N009 0 BC847B
R71 VCTLP VCOBIAS3 15k
R72 N009 0 470
Q9 COM VCOCTL VCTLP 0 BC847B
V3 VCOCTL 0 PWL(0m 1.5 0.1m 1.5 2m 4.2)
R2 COM VCOBIAS3 30k
Q32 OUT1D VREF N034 0 BC847B
Q49 N034 VCOBIAS4 N041 0 BC847B
R38 N041 0 470
Q50 N027 OUT2B N034 0 BC847B
C12 OUT1D VREF 680p
Q159 OUT1B VREF N035 0 BC847B
Q175 N035 N036 N042 0 BC847B
R39 N042 0 220
Q176 N028 OUT1D N035 0 BC847B
Q160 N036 N036 N046 0 BC847B
R42 COM N036 20k
R43 N046 0 470
R44 OUT1B VREF 200
Q177 OUT2D OUT1B N031 0 BC847B
Q180 N031 VCOBIAS4 N038 0 BC847B
R45 N038 0 470
Q181 N025 VREF N031 0 BC847B
C14 OUT2D VREF 680p
Q188 OUT2B VREF N032 0 BC847B
Q189 N032 N036 N039 0 BC847B
R48 N039 0 220
Q190 N026 OUT2D N032 0 BC847B
R51 OUT2B VREF 200
Q178 N024 N020 COM 0 BC857B
Q179 N020 N020 COM 0 BC857B
Q191 N028 N028 N024 0 BC857B
Q192 OUT1B N028 N020 0 BC857B
Q193 N022 N018 COM 0 BC857B
Q197 N018 N018 COM 0 BC857B
Q198 N026 N026 N022 0 BC857B
Q199 OUT2B N026 N018 0 BC857B
Q51 N023 N019 COM 0 BC857B
Q52 N019 N019 COM 0 BC857B
Q53 N027 N027 N023 0 BC857B
Q55 OUT1D N027 N019 0 BC857B
Q62 N021 N017 COM 0 BC857B
Q63 N017 N017 COM 0 BC857B
Q182 N025 N025 N021 0 BC857B
Q183 OUT2D N025 N017 0 BC857B
Q10 OUT1D OUT1D N033 0 BC847B
Q11 N033 VCOBIAS5 N040 0 BC847B
R1 N040 0 20
Q12 N027 VREF N033 0 BC847B
Q14 OUT2D OUT2D N030 0 BC847B
Q15 N030 VCOBIAS5 N037 0 BC847B
R7 N037 0 20
Q16 N025 VREF N030 0 BC847B
Q17 N044 VCOBIAS5 N045 0 BC847B
R14 N045 0 470
Q18 N051 VREF N054 0 BC847B
Q19 N054 VCOBIAS4 N058 0 BC847B
R16 N058 0 270
Q20 N048 OUT2B N054 0 BC847B
Q21 N048 N047 COM 0 BC857B
Q22 VCO1S N047 COM 0 BC857B
Q27 N050 N049 COM 0 BC857B
Q28 N049 N049 COM 0 BC857B
Q23 N052 N055 0 0 BC847B
Q24 VCO1S N055 0 0 BC847B
C2 VCO1S VREF 39p
I1 COM NC_01 500µ
I2 COM NC_02 25µ
Q29 VCOBIAS4 VCOBIAS4 N029 0 BC847B
R18 N029 0 470
Q30 VCOBIAS5 VCOBIAS5 N043 0 BC847B
R19 N043 0 470
V5 NC_03 0 2
R24 COM VCOBIAS4 30k
R25 N016 VCOBIAS4 15k
R26 COM VCOBIAS5 470k
R27 N016 VCOBIAS5 120k
Q34 COM VCOCTL N016 0 BC847B
Q35 N051 SNSDIV N053 0 BC847B
Q36 N053 VCOBIAS5 N056 0 BC847B
R29 N056 0 20
Q37 N048 VREF N053 0 BC847B
Q25 N051 N051 N050 0 BC857B
Q26 N052 N051 N049 0 BC857B
R17 NC_04 VREF 47k
Q38 N006 BIAS_P N003 0 BC857B
Q39 BIAS_P BIAS_P N002 0 BC857B
Q40 0 VCO1S N006 0 BC857B
Q41 COM VCO1S N010 0 BC847B
Q42 N011 N010 N008 0 BC857B
Q43 N001 N006 N008 0 BC847B
R28 COM N002 300
R30 COM N003 100
R31 N013 0 300
R32 N014 0 100
Q44 BIAS_N BIAS_N N013 0 BC847B
Q45 N010 BIAS_N N014 0 BC847B
R34 BIAS_P BIAS_N 20k
Q46 N007 N001 COM 0 BC857B
Q47 N001 N001 COM 0 BC857B
Q48 N011 N011 0 0 BC847B
Q54 N007 N011 0 0 BC847B
C1 N007 0 10p
Q56 N012 N011 0 0 BC847B
Q57 COM N007 N012 0 BC847B
Q58 N005 N001 COM 0 BC857B
Q59 0 N007 N005 0 BC857B
Q60 N004 N005 SENSE2 0 BC847B
Q61 N015 N012 SENSE2 0 BC857B
R46 COM N004 10
R47 N015 0 10
R49 SENSE2 SNSDIV 470
R50 SNSDIV VREF 22
L2 DRIVE2 ANT2 2mH Rser=120 Cpar=1pF
C_ant1 ANT2 0 10pF
R54 SENSE2 DRIVE2 10
R55 SENSE2 N008 10
Q64 N054 VCOBIAS4 N059 0 BC847B
R58 N059 0 270
Q65 N053 VCOBIAS5 N057 0 BC847B
R59 N057 0 20
Q66 COM N052 N055 0 BC847B
Q67 0 N048 N047 0 BC857B
R20 N052 VREF 390k
C3 N006 N010 10000p
.model NPN NPN
.model PNP PNP
.lib standard.bjt
.tran 0 2.1m 0n 0.5n
* D-Lev Theremin new AFE - Current Sensing Sensor v7
.ic V(LP1)=2.26
.ic V(LP2)=2.24
* Control voltage to current converter
.ic V(OU11D)=1.21
.ic V(OUT2D)=1.2
* Unity gain buffer
* Unity gain buffer
* Unity gain buffer
* Unity gain buffer
* Output amplifier
.backanno
.end